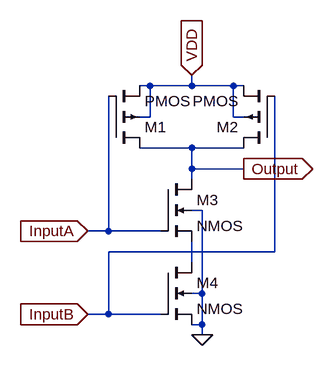
[diagram p0: schematic NAND.asc]
NAND.asc, the LTspice schematic file:
Version 4.1
SHEET 1 880 680
WIRE 192 48 176 48
WIRE 256 48 256 32
WIRE 256 48 192 48
WIRE 320 48 256 48
WIRE 336 48 320 48
WIRE 192 96 192 48
WIRE 192 96 176 96
WIRE 320 96 320 48
WIRE 336 96 320 96
WIRE 256 144 176 144
WIRE 336 144 256 144
WIRE 256 176 256 144
WIRE 336 176 256 176
WIRE 256 192 256 176
WIRE 272 240 256 240
WIRE 128 272 128 64
WIRE 128 272 96 272
WIRE 208 272 128 272
WIRE 384 304 384 64
WIRE 384 304 128 304
WIRE 256 320 256 288
WIRE 272 368 272 240
WIRE 272 368 256 368
WIRE 128 400 128 304
WIRE 128 400 96 400
WIRE 208 400 128 400
WIRE 272 416 272 368
WIRE 272 416 256 416
WIRE 272 432 272 416
FLAG 272 432 0
FLAG 96 272 InputA
IOPIN 96 272 In
FLAG 96 400 InputB
IOPIN 96 400 In
FLAG 336 176 Output
IOPIN 336 176 Out
FLAG 256 32 VDD
IOPIN 256 32 In
SYMBOL pmos4 128 144 M180
SYMATTR InstName M1
SYMATTR Value2 l=1 w=4
SYMBOL pmos4 384 144 R180
SYMATTR InstName M2
SYMATTR Value2 l=1 w=4
SYMBOL nmos4 208 192 R0
SYMATTR InstName M3
SYMATTR Value2 l=1 w=2
SYMBOL nmos4 208 320 R0
SYMATTR InstName M4
SYMATTR Value2 l=1 w=2

The netlist it stands for:
* NAND.asc
M1 Output InputA VDD VDD PMOS l=1 w=4
M2 Output InputB VDD VDD PMOS l=1 w=4
M3 Output InputA N001 0 NMOS l=1 w=2
M4 N001 InputB 0 0 NMOS l=1 w=2
.model NMOS NMOS
.model PMOS PMOS
.lib standard.mos
.backanno
.end